# Altium project Stellaris.PrjPcb (part 3 of 3)

## Sheet ESQUEMATICOS2.SchDoc
size A4; Date: 6/10/2021; Author: Jonathan Menéndez; Organization: Altium Limited; Address1: L3, 12a Rodborough Rd; Address2: Frenchs Forest; Address3: NSW; Address4: Australia 2086; DocumentNumber: 1; Revision: V1.0; SheetNumber: 1; SheetTotal: 4; Size: Letter
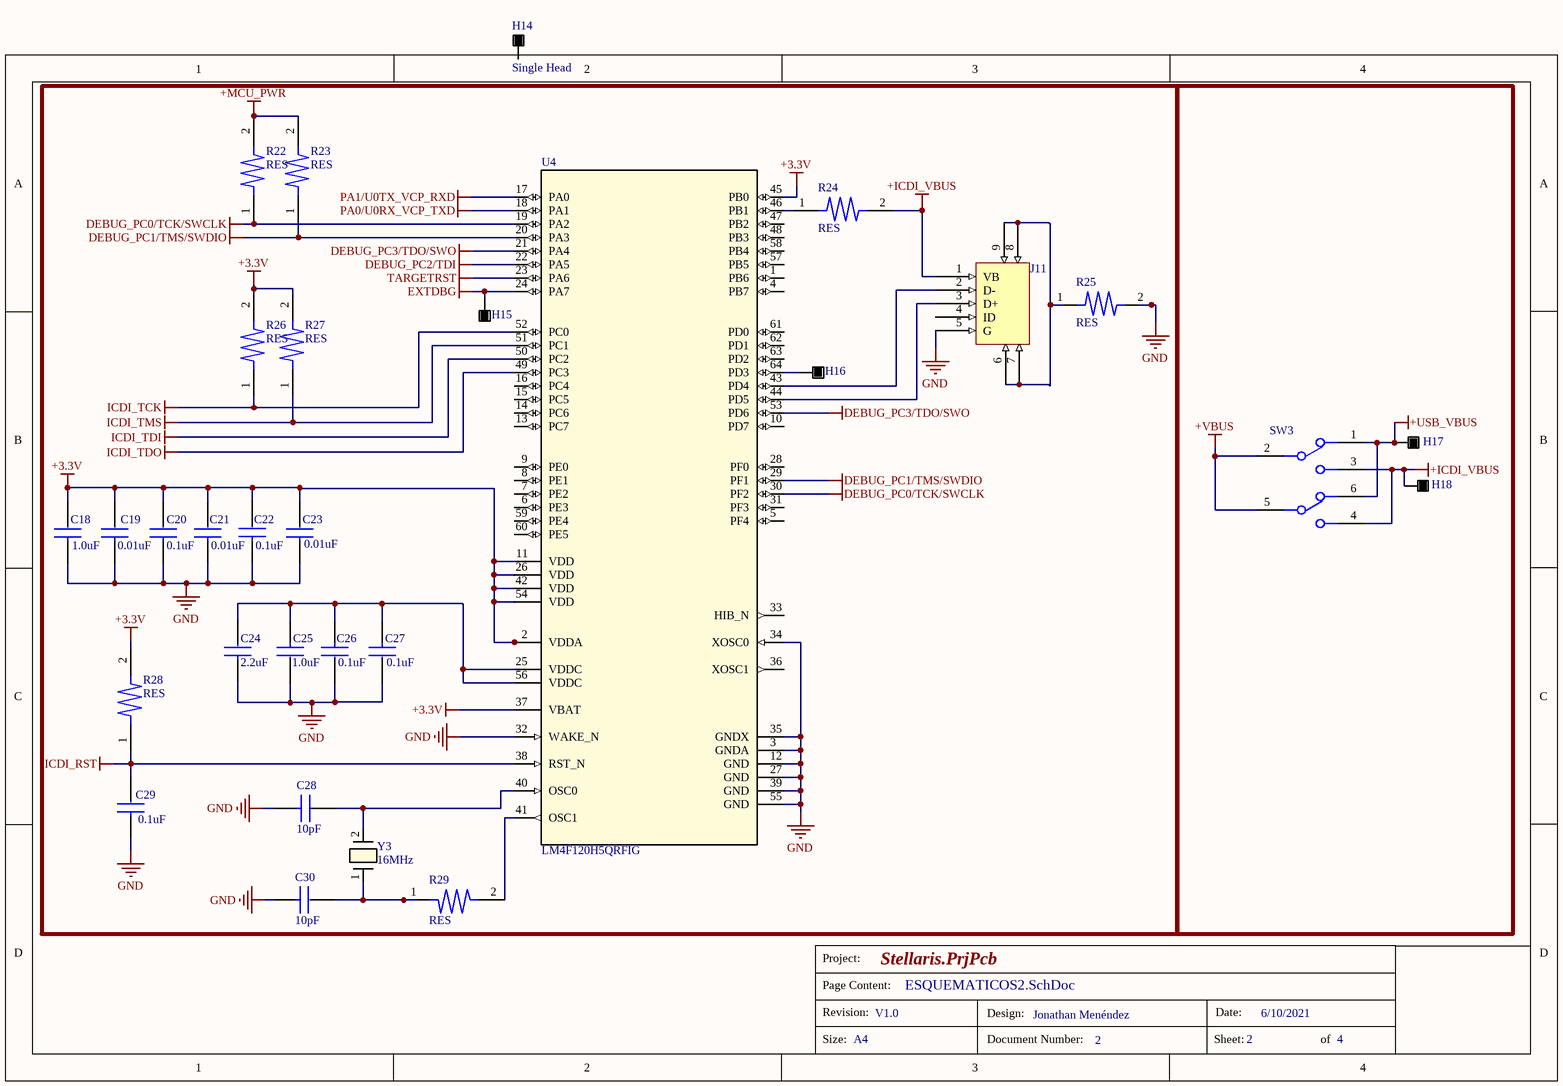
[diagram p1: ESQUEMATICOS2.SchDoc]

### Parts
C18  1.0uF  [CAP 0402]
C19  0.01uF  [CAP 0402]
C20  0.1uF  [CAP 0402]
C21  0.01uF  [CAP 0402]
C22  0.1uF  [CAP 0402]
C23  0.01uF  [CAP 0402]
C24  2.2uF
C25  1.0uF  [CAP 0402]
C26  0.1uF  [CAP 0402]
C27  0.1uF  [CAP 0402]
C28  10pF  [CAP 0402]
C29  0.1uF  [CAP 0402]
C30  10pF  [CAP 0402]
H14  Single Head  [Connector]
H15  Single Head  [Connector]  (value not drawn)
H16  Single Head  [Connector]  (value not drawn)
H17  Single Head  [Connector]  (value not drawn)
H18  Single Head  [Connector]  (value not drawn)
J11  ZX62-B-5PA(11)  [Micro USB 2.0 Type B]  (value not drawn)
R22  RES  [RES 0402]
R23  RES  [RES 0402]
R24  RES  [RES 0402]
R25  RES  [RES 0603]
R26  RES  [RES 0402]
R27  RES  [RES 0402]
R28  RES  [RES 0402]
R29  RES  [RES 0603]
SW3  JS202011SCQN  [JS202011SCQN]  (value not drawn)
U4  LM4F120H5QRFIG  [LM4F120H5QRFIG]
Y3  16MHz  [ABM3-16.000MHZ-B2-T]

### Nets
+3.3V: C18.2 C19.2 C20.2 C21.2 C22.2 C23.2 R26.2 R27.2 R28.2 U4.2(VDDA) U4.11(VDD) U4.26(VDD) U4.37(VBAT) U4.42(VDD) U4.45(PB0) U4.54(VDD)
+ICDI_VBUS: H18.1 J11.1(VB) R24.2 SW3.3 SW3.4
+MCU_PWR: R22.2 R23.2
+USB_VBUS: H17.1 SW3.1 SW3.6
+VBUS: SW3.2 SW3.5
DEBUG_PC0/TCK/SWCLK: R22.1 U4.19(PA2) U4.30(PF2)
DEBUG_PC1/TMS/SWDIO: R23.1 U4.20(PA3) U4.29(PF1)
DEBUG_PC2/TDI: U4.22(PA5)
DEBUG_PC3/TDO/SWO: U4.21(PA4) U4.53(PD6)
EXTDBG: H15.1 U4.24(PA7)
GND: C18.1 C19.1 C20.1 C21.1 C22.1 C23.1 C24.1 C25.2 C26.2 C27.2 C28.1 C29.1 C30.1 J11.5(G) R25.2 U4.3(GNDA) U4.12(GND) U4.27(GND) U4.32(WAKE_N) U4.34(XOSC0) U4.35(GNDX) U4.39(GND) U4.55(GND)
ICDI_RST: C29.2 R28.1 U4.38(RST_N)
ICDI_TCK: R26.1 U4.52(PC0)
ICDI_TDI: U4.50(PC2)
ICDI_TDO: U4.49(PC3)
ICDI_TMS: R27.1 U4.51(PC1)
PA0/U0RX_VCP_TXD: U4.18(PA1)
PA1/U0TX_VCP_RXD: U4.17(PA0)
TARGETRST: U4.23(PA6)
NetC24_2: C24.2 C25.1 C26.1 C27.1 U4.25(VDDC) U4.56(VDDC)
NetC28_2: C28.2 U4.40(OSC0) Y3.2
NetC30_2: C30.2 R29.1 Y3.1
NetH16_1: H16.1 U4.64(PD3)
NetJ11_2: J11.2(D-) U4.43(PD4)
NetJ11_3: J11.3(D+) U4.44(PD5)
NetJ11_6: J11.6 J11.7 J11.8 J11.9 R25.1
NetR24_1: R24.1 U4.46(PB1)
NetR29_2: R29.2 U4.41(OSC1)

Not connected (* = marked no-connect by the designer): H14 1; J11 4(ID); U4 1(PB6) 4(PB7) 5(PF4) 6(PE3) 7(PE2) 8(PE1) 9(PE0) 10(PD7) 13(PC7) 14(PC6) 15(PC5) 16(PC4) 28(PF0) 31(PF3) 33(HIB_N) 36(XOSC1) 47(PB2) 48(PB3) 57(PB5) 58(PB4) 59(PE4) 60(PE5) 61(PD0) 62(PD1) 63(PD2)

### Notes on the sheet
- Project:
- Page Content:
- Revision:
- Design:
- Date:
- Size:
- A4
- Document Number:
- 2
- Sheet:
- of

### Library data of the parts
C18 C20 C22 C26 C27 C29 = EMK105B7104KV-F: 0402 0.1 uF 16 V ±10% Tolerance X7R Multilayer Ceramic Chip Capacitor; Manufacturer: Taiyo Yuden; Capacitance: 100nF; Voltage Rating (DC): 16V; Supplier 1: Digi-Key; Manufacturer Part Number: EMK105B7104KV-F; Stock 1: 4; Pricing 1: 1 = 0.10000, 10 = 0.02400, 50 = 0.01320, 100 = 0.01070, 500 = 0.00764, 1000 = 0.00601, 2500 = 0.00546, 5000 = 0.00503 (USD); RoHS: Yes; Mount: Surface Mount; Case/Package: 0402; Number of Pins: 2; Case Code (Metric): 1005; Case Code (Imperial): 0402; Min Operating Temperature: -55°C; Max Operating Temperature: 125°C; Tolerance: 10%; Packaging: Tape and Reel; Dielectric: X7R; Package Quantity: 1; Voltage Rating: 16V; Termination: SMD/SMT; Series: M; Construction: Flat; Resistor Type: Ceramic; Length: 1mm; Width: 0.02inch; Height: 0.5mm; Thickness: 0.022inch; Depth: 0.5mm; Radiation Hardening: No; Halogen Free: Halogen Free; REACH SVHC: Unknown; RoHS Compliant: Yes; Lead Free: Lead Free; ComponentLink1URL: https://datasheet.ciiva.com/129/emk105b7104kv-f-ss-129714.pdf?src-supplier=Digi-Key; ComponentLink1Description: https://datasheet.ciiva.com/129/emk105b7104kv-f-ss-129714.pdf?src-supplier=Digi-Key; ComponentLink2URL: https://datasheet.ciiva.com/30227/emk105b7104kv-f-30227394.pdf?src-supplier=Onlinecomponents.com; ComponentLink2Description: https://datasheet.ciiva.com/30227/emk105b7104kv-f-30227394.pdf?src-supplier=Onlinecomponents.com; ComponentLink3URL: https://datasheet.ciiva.com/22748/746258-22748959.pdf?src-supplier=Element14; ComponentLink3Description: https://datasheet.ciiva.com/22748/746258-22748959.pdf?src-supplier=Element14; Supplier Part Number 1: 587-1451-1-ND
C19 C21 C23 = TMK105B7103KV-F: 0402 0.01 uF 25 V ±10% X7R Automotive Multilayer Ceramic Capacitor; Manufacturer: Taiyo Yuden; Capacitance: 10nF; Voltage Rating: 25V; Supplier 1: Digi-Key; Manufacturer Part Number: TMK105B7103KV-F; Stock 1: 711807; Pricing 1: 1 = 0.10000, 10 = 0.02200, 50 = 0.01180, 100 = 0.00960, 500 = 0.00684, 1000 = 0.00538, 2500 = 0.00489, 5000 = 0.00450 (USD); RoHS: Yes; Mount: Surface Mount; Case/Package: 0402; Case Code (Metric): 1005; Case Code (Imperial): 0402; Contact Plating: Tin; Min Operating Temperature: -55°C; Max Operating Temperature: 125°C; Tolerance: 10%; Package Quantity: 1; Packaging: Tape and Reel; Voltage Rating (DC): 25V; Dielectric: X7R; Termination: SMD/SMT; Resistor Type: Ceramic; Series: M; Construction: Flat; Voltage: 25V; Length: 1mm; Width: 0.02inch; Height: 0.5mm; Thickness: 0.022inch; Depth: 0.5mm; REACH SVHC: Unknown; Halogen Free: Halogen Free; RoHS Compliant: Yes; ComponentLink1URL: https://datasheet.ciiva.com/129/tmk105b7103kv-f-ss-129699.pdf?src-supplier=Digi-Key; ComponentLink1Description: https://datasheet.ciiva.com/129/tmk105b7103kv-f-ss-129699.pdf?src-supplier=Digi-Key; ComponentLink2URL: https://datasheet.ciiva.com/30192/438tmk105b7103kv-f-30192315.pdf?src-supplier=Onlinecomponents.com; ComponentLink2Description: https://datasheet.ciiva.com/30192/438tmk105b7103kv-f-30192315.pdf?src-supplier=Onlinecomponents.com; ComponentLink3URL: https://datasheet.ciiva.com/15922/204tmk105b7103kv-f-15922348.pdf?src-supplier=Onlinecomponents.com; ComponentLink3Description: https://datasheet.ciiva.com/15922/204tmk105b7103kv-f-15922348.pdf?src-supplier=Onlinecomponents.com; ComponentLink4URL: https://datasheet.ciiva.com/30156/190tmk105b7103kv-f-30156174.pdf?src-supplier=Onlinecomponents.com; ComponentLink4Description: https://datasheet.ciiva.com/30156/190tmk105b7103kv-f-30156174.pdf?src-supplier=Onlinecomponents.com; ComponentLink5URL: https://datasheet.ciiva.com/28645/746258-28645254.pdf?src-supplier=Element14; ComponentLink5Description: https://datasheet.ciiva.com/28645/746258-28645254.pdf?src-supplier=Element14; ComponentLink6URL: https://datasheet.ciiva.com/7975/746258-7975835.pdf?src-supplier=Element14; ComponentLink6Description: https://datasheet.ciiva.com/7975/746258-7975835.pdf?src-supplier=Element14; Supplier Part Number 1: 587-1223-1-ND
C24 = GRM188R61C225KE15D: 0603 2.2 uF 16 V ±10% Tolerance X5R SMT Multilayer Ceramic Capacitor; Manufacturer: Murata; Voltage Rating: 16V; Supplier 1: Arrow Electronics; Manufacturer Part Number: GRM188R61C225KE15D; Stock 1: 64000; Pricing 1: 4000 = 0.08280, 8000 = 0.07540, 12000 = 0.06280, 20000 = 0.05900, 24000 = 0.05760, 100000 = 0.05710 (USD); RoHS: Yes; Mount: Surface Mount; Case/Package: 0603; Case Code (Imperial): 0603; Case Code (Metric): 1608; Material: Ceramic; Min Operating Temperature: -55°C; Max Operating Temperature: 85°C; Capacitance: 2.2uF; Tolerance: 10%; Dielectric: X5R; Voltage Rating (DC): 16V; Packaging: Tape and Reel; Package Quantity: 1; Termination: SMD/SMT; Voltage: 16V; Length: 1.6mm; Width: 0.8mm; Height: 0.8mm; Thickness: 0.035inch; Depth: 0.8mm; Radiation Hardening: No; RoHS Compliant: Yes; Lead Free: Lead Free; REACH SVHC: No SVHC; ComponentLink1URL: https://datasheet.ciiva.com/135/grm188r61c225ke15-01-135062.pdf?src-supplier=Digi-Key; ComponentLink1Description: https://datasheet.ciiva.com/135/grm188r61c225ke15-01-135062.pdf?src-supplier=Digi-Key; ComponentLink2URL: https://datasheet.ciiva.com/135/grm188r61c225ke15-01-135063.pdf?src-supplier=Digi-Key; ComponentLink2Description: https://datasheet.ciiva.com/135/grm188r61c225ke15-01-135063.pdf?src-supplier=Digi-Key; ComponentLink3URL: https://datasheet.ciiva.com/5417/product-5417088.pdf?src-supplier=Mouser; ComponentLink3Description: https://datasheet.ciiva.com/5417/product-5417088.pdf?src-supplier=Mouser; ComponentLink4URL: https://datasheet.ciiva.com/3777/147grm188r61c225ke1523-3777042.pdf?src-supplier=Arrow+Electronics; ComponentLink4Description: https://datasheet.ciiva.com/3777/147grm188r61c225ke1523-3777042.pdf?src-supplier=Arrow+Electronics; ComponentLink5URL: https://datasheet.ciiva.com/29199/454457-da-01-en-vs-kondensator-0603-29199689.pdf?src-supplier=Conrad; ComponentLink5Description: https://datasheet.ciiva.com/29199/454457-da-01-en-vs-kondensator-0603-29199689.pdf?src-supplier=Conrad; ComponentLink6URL: https://datasheet.ciiva.com/135/grm188r61c225ke15-01-135061.pdf?src-supplier=Digi-Key; ComponentLink6Description: https://datasheet.ciiva.com/135/grm188r61c225ke15-01-135061.pdf?src-supplier=Digi-Key; ComponentLink7URL: https://datasheet.ciiva.com/16369/product-16369274.pdf?src-supplier=Future+Electronics; ComponentLink7Description: https://datasheet.ciiva.com/16369/product-16369274.pdf?src-supplier=Future+Electronics; Supplier Part Number 1: GRM188R61C225KE15D
C25 = 100R07X105KV4T: Multilayer Ceramic Capacitor, Tanceram Series, 1 - F, - 10%, X5R, 10 V, 0402 [1005 Metric]; Manufacturer: Johanson; Capacitance: 1uF; Voltage Rating: 10V; Supplier 1: Mouser; Manufacturer Part Number: 100R07X105KV4T; Stock 1: 57482; Pricing 1: 1 = 0.28000, 10 = 0.19300, 50 = 0.19300, 100 = 0.09800, 1000 = 0.06000, 10000 = 0.04800 (USD); RoHS: Yes; Mount: Surface Mount; Case/Package: 0402; Number of Pins: 2; Case Code (Metric): 1005; Case Code (Imperial): 0402; Weight: 2.3E-05oz; Min Operating Temperature: -55°C; Max Operating Temperature: 85°C; Tolerance: 10%; Packaging: Tape and Reel; Package Quantity: 10000; Voltage Rating (DC): 10V; Dielectric: X5R; Termination: SMD/SMT; Series: TANCERAM®; Length: 1.02mm; Width: 0.02inch; Height: 0.64mm; Thickness: 0.025inch; Depth: 0.51mm; Radiation Hardening: No; REACH SVHC: No SVHC; RoHS Compliant: Yes; ComponentLink1URL: https://datasheet.ciiva.com/26948/getdatasheetpartid-789067-26948543.pdf?src-supplier=Verical; ComponentLink1Description: https://datasheet.ciiva.com/26948/getdatasheetpartid-789067-26948543.pdf?src-supplier=Verical; ComponentLink2URL: https://datasheet.ciiva.com/22693/jdi-full-catalog-2012-01-22693744.pdf?src-supplier=Element14; ComponentLink2Description: https://datasheet.ciiva.com/22693/jdi-full-catalog-2012-01-22693744.pdf?src-supplier=Element14; Supplier Part Number 1: 605-100R07X105KV4T
C28 C30 = GRM1555C1H100JZ01D: Cap Ceramic 10pF 50V C0G 5% SMD 0402 125°C Paper T/R; Manufacturer: Murata; Insulation Resistance: 10GR; Temperature Coefficient: 30ppm/°C; Supplier 1: Farnell; Manufacturer Part Number: GRM1555C1H100JZ01D; Stock 1: 0; Pricing 1: 1 = 37.68000, 3 = 28.53000 (GBP); RoHS: Yes; Mount: Surface Mount; Case/Package: 0402; Number of Pins: 2; Case Code (Imperial): 0402; Case Code (Metric): 1005; Dielectric Material: Ceramic; Min Operating Temperature: -55°C; Max Operating Temperature: 125°C; Capacitance: 10pF; Tolerance: 5%; Dielectric: C0G; Voltage Rating: 50V; Voltage Rating (DC): 50V; Packaging: Tape and Reel; Package Quantity: 1; Termination: SMD/SMT; Voltage: 50V; Series: GRM; Construction: Flat; Length: 1mm; Width: 0.5mm; Height: 0.5mm; Thickness: 0.022inch; Depth: 0.5mm; Size: 0.5mm; Radiation Hardening: No; REACH SVHC: No SVHC; Lead Free: Lead Free; RoHS Compliant: Yes; ComponentLink1URL: https://datasheet.ciiva.com/129/partnumbering-e-01-129819.pdf?src-supplier=Digi-Key; ComponentLink1Description: https://datasheet.ciiva.com/129/partnumbering-e-01-129819.pdf?src-supplier=Digi-Key; ComponentLink2URL: https://datasheet.ciiva.com/129/partnumbering-e-01-129820.pdf?src-supplier=Digi-Key; ComponentLink2Description: https://datasheet.ciiva.com/129/partnumbering-e-01-129820.pdf?src-supplier=Digi-Key; ComponentLink3URL: https://datasheet.ciiva.com/129/partnumbering-e-01-129821.pdf?src-supplier=Digi-Key; ComponentLink3Description: https://datasheet.ciiva.com/129/partnumbering-e-01-129821.pdf?src-supplier=Digi-Key; ComponentLink4URL: https://datasheet.ciiva.com/19476/1855887-19476237.pdf?src-supplier=Jameco; ComponentLink4Description: https://datasheet.ciiva.com/19476/1855887-19476237.pdf?src-supplier=Jameco; ComponentLink5URL: https://datasheet.ciiva.com/18184/getdatasheetpartid-91958-18184166.pdf?src-supplier=Verical; ComponentLink5Description: https://datasheet.ciiva.com/18184/getdatasheetpartid-91958-18184166.pdf?src-supplier=Verical; ComponentLink6URL: https://datasheet.ciiva.com/11787/0900766b807a1cab-11787097.pdf?src-supplier=RSComponents; ComponentLink6Description: https://datasheet.ciiva.com/11787/0900766b807a1cab-11787097.pdf?src-supplier=RSComponents; ComponentLink7URL: https://datasheet.ciiva.com/6068/1747431-6068159.pdf?src-supplier=Farnell; ComponentLink7Description: https://datasheet.ciiva.com/6068/1747431-6068159.pdf?src-supplier=Farnell; ComponentLink8URL: https://datasheet.ciiva.com/11607/c02e-11607480.pdf?src-supplier=Avnet; ComponentLink8Description: https://datasheet.ciiva.com/11607/c02e-11607480.pdf?src-supplier=Avnet; ComponentLink9URL: https://datasheet.ciiva.com/14116/grmseries-tc-hitype-eng-14116856.pdf?src-supplier=Distrelec; ComponentLink9Description: https://datasheet.ciiva.com/14116/grmseries-tc-hitype-eng-14116856.pdf?src-supplier=Distrelec; ComponentLink10URL: https://datasheet.ciiva.com/14116/grmseries-tc-hitype-eng-14116917.pdf?src-supplier=Distrelec; ComponentLink10Description: https://datasheet.ciiva.com/14116/grmseries-tc-hitype-eng-14116917.pdf?src-supplier=Distrelec; ComponentLink11URL: https://datasheet.ciiva.com/7828/1747431-7828813.pdf?src-supplier=Element14; ComponentLink11Description: https://datasheet.ciiva.com/7828/1747431-7828813.pdf?src-supplier=Element14; ComponentLink12URL: https://datasheet.ciiva.com/7828/1747431-7828815.pdf?src-supplier=Element14; ComponentLink12Description: https://datasheet.ciiva.com/7828/1747431-7828815.pdf?src-supplier=Element14; Supplier Part Number 1: 1118131
H14-H18 = Single Head: Connector
J11 = ZX62-B-5PA(11): Conn Micro USB 2.0 Type B RCP 5 POS 0.65mm Solder RA SMD 5 Terminal 1 Port T/R; Manufacturer: Hirose; Number of Terminals/Pins: 5; Connector Type: USB,Receptacle; Gender: Receptacle; Current Rating: 1A; Mating Cycles: 10000; Voltage Rating: 30V; Number of Ports: 1; USB Standard: USB 2.0; Supplier 1: Farnell; Manufacturer Part Number: ZX62-B-5PA(11); Stock 1: 0; Pricing 1: 10 = 0.60800, 50 = 0.48000, 100 = 0.44900, 250 = 0.43000, 500 = 0.39100, 1000 = 0.35900 (GBP); RoHS: Yes; Mount: Surface Mount,Horizontal; Contact Plating: Gold; Contact Material: Copper Alloy; Min Operating Temperature: -30°C; Max Operating Temperature: 85°C; Packaging: Tape and Reel; Number of Contacts: 5; Package Quantity: 3500; Series: ZX62; Termination: Solder; Orientation: Right Angle; Number of Positions: 5; Max Voltage Rating (AC): 30V; Voltage Rating (AC): 30V; Length: 7.9mm; Pitch: 0.65mm; Depth: 5.6mm; Radiation Hardening: No; RoHS Compliant: Yes; REACH SVHC: No SVHC; Lead Free: Lead Free; Flammability Rating: UL94 V-0; ComponentLink1URL: https://datasheet.ciiva.com/11731/0900766b80d9c4df-11731324.pdf?src-supplier=RSComponents; ComponentLink1Description: https://datasheet.ciiva.com/11731/0900766b80d9c4df-11731324.pdf?src-supplier=RSComponents; ComponentLink2URL: https://datasheet.ciiva.com/15181/getdatasheetpartid-449685-15181366.pdf?src-supplier=Verical; ComponentLink2Description: https://datasheet.ciiva.com/15181/getdatasheetpartid-449685-15181366.pdf?src-supplier=Verical; ComponentLink3URL: https://datasheet.ciiva.com/7646/81390-7646778.pdf?src-supplier=Element14; ComponentLink3Description: https://datasheet.ciiva.com/7646/81390-7646778.pdf?src-supplier=Element14; Supplier Part Number 1: 1645325
R22 R23 R26-R28 = RC0402FR-0710KL: Res General Purpose Thick Film 0402 10K Ohm 1% 1/16W ±100ppm/°C Molded SMD Paper T/R; Manufacturer: Yageo; Resistance: 10kR; Voltage Rating (DC): 50V; Power Rating: 62.5mW; Max Power Dissipation: 63mW; Supplier 1: RSComponents; Manufacturer Part Number: RC0402FR-0710KL; Stock 1: 29900; Pricing 1: 1000 = 0.03100, 2000 = 0.02800, 5000 = 0.02300 (GBP); RoHS: Yes; Case/Package: 0402; Number of Pins: 2; Case Code (Imperial): 0402; Case Code (Metric): 1005; Min Operating Temperature: -55°C; Max Operating Temperature: 155°C; Resistor Type: Thick Film; Tolerance: 1%; Temperature Coefficient: 100ppm/°C; Packaging: Tape and Reel; Voltage Rating: 50V; Termination: SMD/SMT; Working Voltage: 50V; Number of Terminations: 2; Features: Moisture Resistant; Series: RC; Resistance Tolerance: 1%; Construction: Rectangular; Length: 1mm; Width: 0.5mm; Height: 0.32mm; Depth: 0.5mm; Lead Pitch: 0.2mm; REACH SVHC: No SVHC; Lead Free: Lead Free; RoHS Compliant: Yes; Military Standard: Not; ComponentLink1URL: https://datasheet.ciiva.com/7660/38568-7660787.pdf?src-supplier=Element14; ComponentLink1Description: https://datasheet.ciiva.com/7660/38568-7660787.pdf?src-supplier=Element14; ComponentLink2URL: https://datasheet.ciiva.com/12667/pyu-rc0402-51-rohs-l-6-r-12667067.pdf?src-supplier=Mouser; ComponentLink2Description: https://datasheet.ciiva.com/12667/pyu-rc0402-51-rohs-l-6-r-12667067.pdf?src-supplier=Mouser; ComponentLink3URL: https://datasheet.ciiva.com/7849/1784430-7849813.pdf?src-supplier=Element14; ComponentLink3Description: https://datasheet.ciiva.com/7849/1784430-7849813.pdf?src-supplier=Element14; ComponentLink4URL: https://datasheet.ciiva.com/7849/1686128-7849814.pdf?src-supplier=Element14; ComponentLink4Description: https://datasheet.ciiva.com/7849/1686128-7849814.pdf?src-supplier=Element14; ComponentLink5URL: https://datasheet.ciiva.com/7849/1784430-7849815.pdf?src-supplier=Element14; ComponentLink5Description: https://datasheet.ciiva.com/7849/1784430-7849815.pdf?src-supplier=Element14; ComponentLink6URL: https://datasheet.ciiva.com/7983/1018594-7983486.pdf?src-supplier=Element14; ComponentLink6Description: https://datasheet.ciiva.com/7983/1018594-7983486.pdf?src-supplier=Element14; ComponentLink7URL: https://datasheet.ciiva.com/22747/1018594-22747512.pdf?src-supplier=Element14; ComponentLink7Description: https://datasheet.ciiva.com/22747/1018594-22747512.pdf?src-supplier=Element14; Supplier Part Number 1: 1987644P
R24 = RC0402FR-07330RL: Res Thick Film 0402 330 Ohm 1% 0.063W(1/16W) ±100ppm/C Pad SMD T/R; Manufacturer: Yageo; Resistance: 330R; Temperature Coefficient: 100ppm/°C; Power Rating: 62.5mW; Voltage Rating: 50V; Max Power Dissipation: 63mW; Supplier 1: Digi-Key; Manufacturer Part Number: RC0402FR-07330RL; Stock 1: 664783; Pricing 1: 1 = 0.10000, 10 = 0.01600, 100 = 0.00660, 1000 = 0.00299, 2500 = 0.00259, 5000 = 0.00214 (USD); RoHS: Yes; Case/Package: 0402; Case Code (Metric): 1005; Case Code (Imperial): 0402; Size Code: 0402; Min Operating Temperature: -55°C; Max Operating Temperature: 155°C; Packaging: Tape and Reel; Tolerance: 1%; Package Quantity: 1; Resistor Type: Thick Film; Number of Terminations: 2; Termination: SMD/SMT; Features: Moisture Resistant; Series: RC; Construction: Rectangular; Technology: THICK FILM; Resistance Tolerance: 1%; Length: 0.039inch; Width: 0.02inch; Height: 0.016inch; Depth: 0.5mm; RoHS Compliant: Yes; REACH SVHC: Unknown; Military Standard: Not; Lead Free: Lead Free; ComponentLink1URL: https://datasheet.ciiva.com/11819/0900766b80c66297-11819490.pdf?src-supplier=RSComponents; ComponentLink1Description: https://datasheet.ciiva.com/11819/0900766b80c66297-11819490.pdf?src-supplier=RSComponents; ComponentLink2URL: https://datasheet.ciiva.com/12656/pyu-rc0402-51-rohs-l-6-r-12656815.pdf?src-supplier=Mouser; ComponentLink2Description: https://datasheet.ciiva.com/12656/pyu-rc0402-51-rohs-l-6-r-12656815.pdf?src-supplier=Mouser; ComponentLink3URL: https://datasheet.ciiva.com/2453/pyu-r-int-thick-7-2453661.pdf?src-supplier=Digi-Key; ComponentLink3Description: https://datasheet.ciiva.com/2453/pyu-r-int-thick-7-2453661.pdf?src-supplier=Digi-Key; ComponentLink4URL: https://datasheet.ciiva.com/2453/pyu-r-int-thick-7-2453662.pdf?src-supplier=Digi-Key; ComponentLink4Description: https://datasheet.ciiva.com/2453/pyu-r-int-thick-7-2453662.pdf?src-supplier=Digi-Key; ComponentLink5URL: https://datasheet.ciiva.com/2453/pyu-r-int-thick-7-2453663.pdf?src-supplier=Digi-Key; ComponentLink5Description: https://datasheet.ciiva.com/2453/pyu-r-int-thick-7-2453663.pdf?src-supplier=Digi-Key; ComponentLink6URL: https://datasheet.ciiva.com/7849/1018594-7849962.pdf?src-supplier=Element14; ComponentLink6Description: https://datasheet.ciiva.com/7849/1018594-7849962.pdf?src-supplier=Element14; ComponentLink7URL: https://datasheet.ciiva.com/7849/1018594-7849963.pdf?src-supplier=Element14; ComponentLink7Description: https://datasheet.ciiva.com/7849/1018594-7849963.pdf?src-supplier=Element14; ComponentLink8URL: https://datasheet.ciiva.com/17083/pyu-rc0402-51-rohs-l-6-r-17083994.pdf?src-supplier=Future+Electronics; ComponentLink8Description: https://datasheet.ciiva.com/17083/pyu-rc0402-51-rohs-l-6-r-17083994.pdf?src-supplier=Future+Electronics; Supplier Part Number 1: 311-330LRCT-ND
R25 R29 = ERJ-3GEY0R00V: ERJ Series 0603 0 Ohm 0.1 W Jumper Surface Mount Thick Film Chip Resistor; Manufacturer: Panasonic; Resistance: 0R; Power Rating: 100mW; Voltage Rating: 75V; Tolerance: 0%; Temperature Coefficient: 600ppm/°C; Voltage Rating (DC): 50V; Supplier 1: Future Electronics; Manufacturer Part Number: ERJ-3GEY0R00V; Stock 1: 5000; Pricing 1: 5000 = 0.01170 (USD); RoHS: Yes; Mount: Surface Mount; Case/Package: 0603; Contact Plating: Tin; Case Code (Metric): 1608; Case Code (Imperial): 0603; Size Code: 0603; Min Operating Temperature: -55°C; Max Operating Temperature: 155°C; Resistor Type: Thick Film; Packaging: Tape and Reel; Package Quantity: 1; Number of Terminations: 2; Termination: SMD/SMT; Max Power Dissipation: 100mW; Features: Automotive AEC-Q200; Series: ERJ; Construction: Rectangular; Technology: THICK FILM; Length: 1.6mm; Width: 0.031inch; Height: 0.45mm; Depth: 0.8mm; Radiation Hardening: No; REACH SVHC: No SVHC; Military Standard: Not; Lead Free: Lead Free; RoHS Compliant: Yes; ComponentLink1URL: https://datasheet.ciiva.com/11808/0900766b80f806dd-11808207.pdf?src-supplier=RSComponents; ComponentLink1Description: https://datasheet.ciiva.com/11808/0900766b80f806dd-11808207.pdf?src-supplier=RSComponents; ComponentLink2URL: https://datasheet.ciiva.com/27055/1935748-27055113.pdf?src-supplier=Jameco; ComponentLink2Description: https://datasheet.ciiva.com/27055/1935748-27055113.pdf?src-supplier=Jameco; ComponentLink3URL: https://datasheet.ciiva.com/48532/aoa0000ce1-48532165.pdf?src-supplier=Avnet; ComponentLink3Description: https://datasheet.ciiva.com/48532/aoa0000ce1-48532165.pdf?src-supplier=Avnet; ComponentLink4URL: https://datasheet.ciiva.com/5959/1678796-5959707.pdf?src-supplier=Farnell; ComponentLink4Description: https://datasheet.ciiva.com/5959/1678796-5959707.pdf?src-supplier=Farnell; ComponentLink5URL: https://datasheet.ciiva.com/43460/1678796-43460647.pdf?src-supplier=Farnell; ComponentLink5Description: https://datasheet.ciiva.com/43460/1678796-43460647.pdf?src-supplier=Farnell; ComponentLink6URL: https://datasheet.ciiva.com/9198/aoa0000ce1-9198975.pdf?src-supplier=Avnet; ComponentLink6Description: https://datasheet.ciiva.com/9198/aoa0000ce1-9198975.pdf?src-supplier=Avnet; ComponentLink7URL: https://datasheet.ciiva.com/30199/4aoa0000ce1-30199822.pdf?src-supplier=Onlinecomponents.com; ComponentLink7Description: https://datasheet.ciiva.com/30199/4aoa0000ce1-30199822.pdf?src-supplier=Onlinecomponents.com; ComponentLink8URL: https://datasheet.ciiva.com/16758/70255313-16758527.pdf?src-supplier=Allied+Electronics; ComponentLink8Description: https://datasheet.ciiva.com/16758/70255313-16758527.pdf?src-supplier=Allied+Electronics; ComponentLink9URL: https://datasheet.ciiva.com/16834/aoa0000ce1-16834828.pdf?src-supplier=Future+Electronics; ComponentLink9Description: https://datasheet.ciiva.com/16834/aoa0000ce1-16834828.pdf?src-supplier=Future+Electronics; ComponentLink10URL: https://datasheet.ciiva.com/46377/1678796-46377868.pdf?src-supplier=Element14; ComponentLink10Description: https://datasheet.ciiva.com/46377/1678796-46377868.pdf?src-supplier=Element14; ComponentLink11URL: https://datasheet.ciiva.com/28695/1678796-28695833.pdf?src-supplier=Element14; ComponentLink11Description: https://datasheet.ciiva.com/28695/1678796-28695833.pdf?src-supplier=Element14; ComponentLink12URL: https://datasheet.ciiva.com/17215/aoa0000ce1-17215388.pdf?src-supplier=Avnet+Europe; ComponentLink12Description: https://datasheet.ciiva.com/17215/aoa0000ce1-17215388.pdf?src-supplier=Avnet+Europe; Supplier Part Number 1: 9028511
SW3 = JS202011SCQN: C&k Components JS202011SCQN / Switch Slide DPDT 6VDC 0.3A SMT; Manufacturer: ITT C&K; Actuator Material: Nylon,Polyamide,PA46; Actuator Color: Black; Max Voltage Rating (DC): 6V; Contact Resistance: 70mR; Max Current Rating: 300mA; Electrical Life: 5000Cycles; Switch Travel: 2mm; Switch Function: On-On; Actuator Type: Standard; Supplier 1: Digi-Key; Manufacturer Part Number: JS202011SCQN; Stock 1: 102163; Pricing 1: 1 = 0.55000, 10 = 0.53000, 25 = 0.51040, 100 = 0.44180, 250 = 0.40252, 500 = 0.37306 (USD); RoHS: Yes; Mount: Surface Mount; Contact Material: Copper Alloy; Contact Plating: Silver; Housing Material: Nylon; Min Operating Temperature: -20°C; Max Operating Temperature: 85°C; Throw Configuration: DPDT; Termination: Gull Wing; Voltage Rating (DC): 6V; Packaging: Tape and Reel; Contact Current Rating: 300mA; Package Quantity: 1; Current Rating: 300mA; Orientation: Vertical; Series: JS; Length: 9mm; Depth: 7.5mm; Actuator Length: 2mm; Radiation Hardening: No; REACH SVHC: No SVHC; Lead Free: Lead Free; Flammability Rating: UL94 V-2; ComponentLink1URL: https://datasheet.ciiva.com/2889/js-29aug13-2889127.pdf?src-supplier=Digi-Key; ComponentLink1Description: https://datasheet.ciiva.com/2889/js-29aug13-2889127.pdf?src-supplier=Digi-Key; ComponentLink2URL: https://datasheet.ciiva.com/23829/1707718-23829488.pdf?src-supplier=Newark; ComponentLink2Description: https://datasheet.ciiva.com/23829/1707718-23829488.pdf?src-supplier=Newark; ComponentLink3URL: https://datasheet.ciiva.com/8625/js-9dec14-8625470.pdf?src-supplier=Avnet; ComponentLink3Description: https://datasheet.ciiva.com/8625/js-9dec14-8625470.pdf?src-supplier=Avnet; ComponentLink4URL: https://datasheet.ciiva.com/2889/js-15sept15-2889128.pdf?src-supplier=Digi-Key; ComponentLink4Description: https://datasheet.ciiva.com/2889/js-15sept15-2889128.pdf?src-supplier=Digi-Key; ComponentLink5URL: https://datasheet.ciiva.com/2889/js-15sept15-2889129.pdf?src-supplier=Digi-Key; ComponentLink5Description: https://datasheet.ciiva.com/2889/js-15sept15-2889129.pdf?src-supplier=Digi-Key; ComponentLink6URL: https://datasheet.ciiva.com/22630/1707718-22630697.pdf?src-supplier=Element14; ComponentLink6Description: https://datasheet.ciiva.com/22630/1707718-22630697.pdf?src-supplier=Element14; Supplier Part Number 1: 401-2002-1-ND
U4 = LM4F120H5QRFIG: MCU 32-bit Stellaris ARM Cortex M4F RISC 256KB Flash 1.2V/3.3V 64-Pin LQFP Tray; Manufacturer: Texas Instruments; RAM Size: 32KB; Max Power Dissipation: 560mW; Interface: I2C,USB,CAN,UART; Number of Timers/Counters: 13; Data Bus Width: 32b; Number of Programmable I/O: 43; Watchdog Timer: Yes; Max Frequency: 80MHz; Supplier 1: Arrow Electronics; Manufacturer Part Number: LM4F120H5QRFIG; Stock 1: 0; RoHS: Yes; Case/Package: LQFP; Min Operating Temperature: -40°C; Max Operating Temperature: 85°C; Packaging: Tray; Memory Type: FLASH; Memory Size: 256KB; Core Architecture: ARM; Radiation Hardening: No; RoHS Compliant: Yes; ComponentLink1URL: http://www.ti.com/lit/ds/symlink/lm4f120h5qr.pdf?src-supplier=Avnet; ComponentLink1Description: http://www.ti.com/lit/ds/symlink/lm4f120h5qr.pdf?src-supplier=Avnet; Supplier Part Number 1: LM4F120H5QRFIG
Y3 = ABM3-16.000MHZ-B2-T: Crystal 16MHz ±20ppm (Tol) ±50ppm (Stability) 18pF FUND 40Ohm 2-Pin Mini-CSMD T/R; Manufacturer: Abracon; ESR (Equivalent Series Resistance): 40R; Series Resistance: 60R; Supplier 1: Newark; Manufacturer Part Number: ABM3-16.000MHZ-B2-T; Stock 1: 928; Pricing 1: 1 = 0.92700, 10 = 0.88000 (USD); RoHS: Yes; Mount: Surface Mount; Case/Package: CSMD; Number of Pins: 2; Min Operating Temperature: -20°C; Max Operating Temperature: 70°C; Frequency: 16MHz; Load Capacitance: 18pF; Packaging: Tape and Reel; Frequency Tolerance: 20ppm; Package Quantity: 1000; Tolerance: 20ppm; Frequency Stability: 50ppm; Termination: SMD/SMT; Resistor Type: Ceramic; Accuracy: 20ppm; Series: ABM3; Operating Frequency: 16 MHz; Length: 5mm; Width: 3.2mm; Height: 0.051inch; Depth: 3.2mm; REACH SVHC: Yes; Lead Free: Lead Free; ComponentLink1URL: https://datasheet.ciiva.com/15116/getdatasheetpartid-719852-15116752.pdf?src-supplier=Verical; ComponentLink1Description: https://datasheet.ciiva.com/15116/getdatasheetpartid-719852-15116752.pdf?src-supplier=Verical; ComponentLink2URL: https://datasheet.ciiva.com/855/abm3-855737.pdf?src-supplier=Digi-Key; ComponentLink2Description: https://datasheet.ciiva.com/855/abm3-855737.pdf?src-supplier=Digi-Key; ComponentLink3URL: https://datasheet.ciiva.com/855/abm3-855738.pdf?src-supplier=Digi-Key; ComponentLink3Description: https://datasheet.ciiva.com/855/abm3-855738.pdf?src-supplier=Digi-Key; ComponentLink4URL: https://datasheet.ciiva.com/855/abm3-855739.pdf?src-supplier=Digi-Key; ComponentLink4Description: https://datasheet.ciiva.com/855/abm3-855739.pdf?src-supplier=Digi-Key; ComponentLink5URL: https://datasheet.ciiva.com/4945/abm3-47699-4945240.pdf?src-supplier=Mouser; ComponentLink5Description: https://datasheet.ciiva.com/4945/abm3-47699-4945240.pdf?src-supplier=Mouser; ComponentLink6URL: https://datasheet.ciiva.com/16209/abm3-16209965.pdf?src-supplier=Future+Electronics; ComponentLink6Description: https://datasheet.ciiva.com/16209/abm3-16209965.pdf?src-supplier=Future+Electronics; Supplier Part Number 1: 13J1720

## Nets that join several sheets
+3.3V: ESQUEMATICOS1 (8 pins), ESQUEMATICOS2 (16 pins)
+MCU_PWR: ESQUEMATICOS1 (17 pins), ESQUEMATICOS2 (R22.2 R23.2)
+USB_VBUS: ESQUEMATICOS1 (J9.1 R13.2), ESQUEMATICOS2 (H17.1 SW3.1 SW3.6)
+VBUS: ESQUEMATICOS1 (7 pins), ESQUEMATICOS2 (SW3.2 SW3.5)
DEBUG_PC0/TCK/SWCLK: ESQUEMATICOS1 (U1.52), ESQUEMATICOS2 (R22.1 U4.19 U4.30)
DEBUG_PC1/TMS/SWDIO: ESQUEMATICOS1 (U1.51), ESQUEMATICOS2 (R23.1 U4.20 U4.29)
DEBUG_PC2/TDI: ESQUEMATICOS1 (U1.50), ESQUEMATICOS2 (U4.22)
DEBUG_PC3/TDO/SWO: ESQUEMATICOS1 (U1.49), ESQUEMATICOS2 (U4.21 U4.53)
GND: ESQUEMATICOS1 (41 pins), ESQUEMATICOS2 (23 pins)
ICDI_RST: ESQUEMATICOS1 (D2.1), ESQUEMATICOS2 (C29.2 R28.1 U4.38)
PA0/U0RX_VCP_TXD: ESQUEMATICOS1 (U1.17), ESQUEMATICOS2 (U4.18)
PA1/U0TX_VCP_RXD: ESQUEMATICOS1 (U1.18), ESQUEMATICOS2 (U4.17)
TARGETRST: ESQUEMATICOS1 (8 pins), ESQUEMATICOS2 (U4.23)